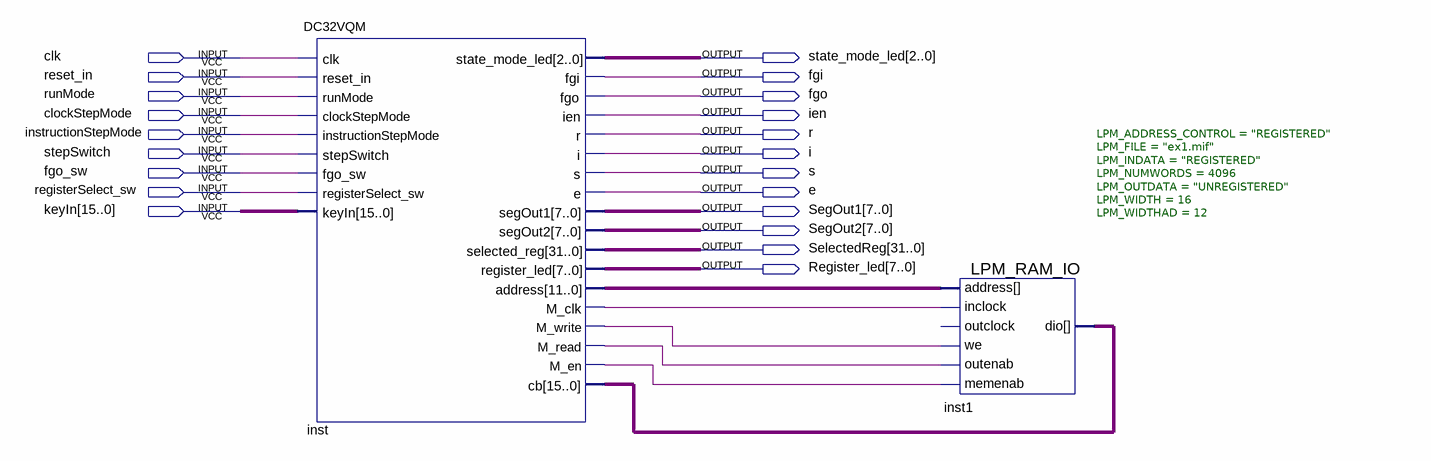
[diagram p0: schematic sheet]
// Quartus schematic DigCom32.bdf as structural Verilog: 2 symbols, 21 pins
module DigCom32 (
  input  clk,
  input  reset_in,
  input  runMode,
  input  clockStepMode,
  input  instructionStepMode,
  input  stepSwitch,
  input  fgo_sw,
  input  registerSelect_sw,
  input  [15:0] keyIn,
  output [2:0] state_mode_led,
  output fgi,
  output fgo,
  output ien,
  output r,
  output i,
  output s,
  output e,
  output [7:0] SegOut1,
  output [7:0] SegOut2,
  output [31:0] SelectedReg,
  output [7:0] Register_led
);

  wire inst_m_clk, inst_m_en, inst_m_read, inst_m_write;
  wire [11:0] inst_address;
  wire [15:0] inst_cb;

  DC32VQM inst (
    .clk(clk), .reset_in(reset_in), .runMode(runMode), .clockStepMode(clockStepMode),
    .instructionStepMode(instructionStepMode), .stepSwitch(stepSwitch), .fgo_sw(fgo_sw),
    .registerSelect_sw(registerSelect_sw), .keyIn(keyIn), .state_mode_led(state_mode_led), .fgi(fgi),
    .fgo(fgo), .ien(ien), .r(r), .i(i), .s(s), .e(e), .segOut1(SegOut1), .segOut2(SegOut2),
    .selected_reg(SelectedReg), .register_led(Register_led), .address(inst_address), .M_clk(inst_m_clk),
    .M_write(inst_m_write), .M_read(inst_m_read), .M_en(inst_m_en), .cb(inst_cb));
  LPM_RAM_IO #(.LPM_ADDRESS_CONTROL("REGISTERED"), .LPM_FILE("ex1.mif"), .LPM_INDATA("REGISTERED"), .LPM_NUMWORDS(4096), .LPM_OUTDATA("UNREGISTERED"), .LPM_WIDTH(16), .LPM_WIDTHAD(12)) inst1 (
    .address(inst_address), .memenab(inst_m_en), .inclock(inst_m_clk), .we(inst_m_write),
    .outenab(inst_m_read), .dio(inst_cb));  // open: outclock
endmodule
